# Altium schematic sheet NewPSU.SchDoc
size A4; SheetNumber: 6; SheetTotal: 6
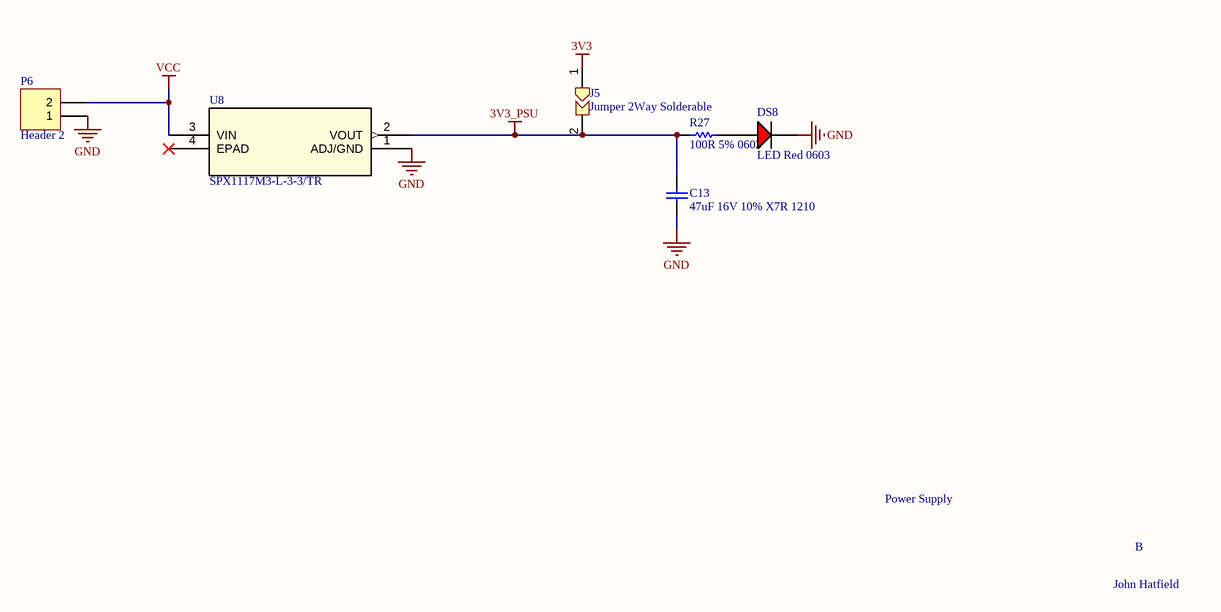
[diagram p0: NewPSU.SchDoc]

## Parts
C13  47uF 16V 10% X7R 1210  [Cap_Ceramic_1210]
DS8  LED Red 0603  [LED RED 0603]
J5  Jumper 2Way Solderable  [Jumper_2Way_Solderable]
P6  Header 2  [HDR1X2]
R27  100R 5% 0603  [Res_ThinFilm_0603]
U8  SPX1117M3-L-3-3/TR  [SOT223-3_MXL]

## Nets
3V3: J5.1
3V3_PSU: C13.2 J5.2 R27.1 U8.2(VOUT)
GND: C13.1 DS8.2(C) P6.1 U8.1(ADJ/GND)
VCC: P6.2 U8.3(VIN)
NetDS8_1: DS8.1(A) R27.2

Not connected (* = marked no-connect by the designer): U8 4(EPAD)*

## Notes on the sheet
- Power Supply
- B
- John Hatfield
- THIS DOCUMENT AND THE DATA DISCLOSED HEREIN OR
- HEREWITH IS THE PROPERTY OF ALTIUM LIMITED AND MAY
- DWG NO:
- REVISION
- REV:
- DESCRIPTION
- DATE
- APPROVED
- BE FREELY DISTRIBUTED IN WHOLE. NO RIGHTS ARE
- RESERVED OR EXPRESS OR IMPLIED WARANTEE GIVEN.
- ENG:
- APPROVALS
- PROJECT
- DSN:
- CHK:
- REFERENCE DOCUMENTS
- PROJECT REVISION:
- TITLE
- DOCUMENT REVISION:
- DESIGN ITEM:
- BOM:
- FAB DWG:
- PCB DWG:
- ASSY DWG:
- SCALE:
- A3
- SIZE
- CAGE CODE
- FILE NAME
- DWG NO.
- SHEET
- OF
- REV

## Library data of the parts
C13 = 47uF 16V 10% X7R 1210: Capacitor, Ceramic, SMD, 47uF, 16V, 5%, X7R, 1210
J5 = Jumper 2Way Vert Solderable
P6 = Header 2: Header, 2-Pin; LatestRevisionDate: 17-Jul-2002; LatestRevisionNote: Re-released for DXP Platform.; Publisher: Altium Limited
R27 = 100R 5%, 0603: Resistor, SMD, 100R, 0.1W, 5%, 0603
U8 = SPX1117M3-L-3-3/TR: No Description Available; Vendor: Max Linear; Built_By: EMA_Molly; SourceLibrary: Max_Linear_2019-12-20; Manufacturer_Part_Number: SPX1117M3-L-3-3/TR; Copyright: Copyright (C) 2018 Accelerated Designs. All rights reserved; RefDes: RefDes; Type: DEV